# EAGLE design NFCAccessController (EAGLE 6.2)
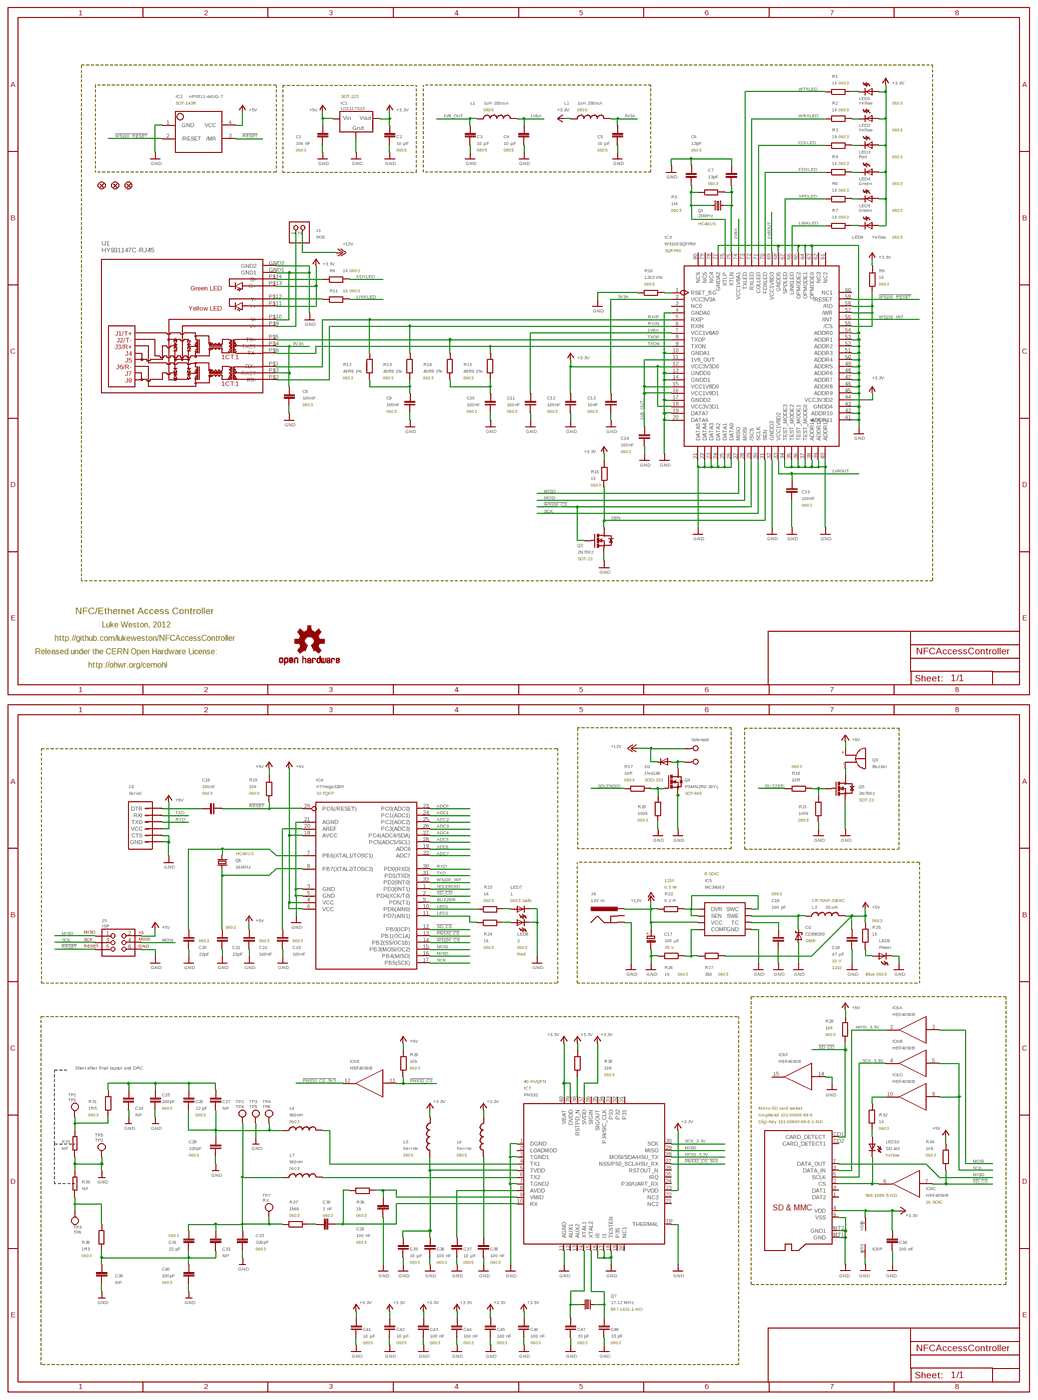
[diagram p0: schematic, sheet 1, overview]
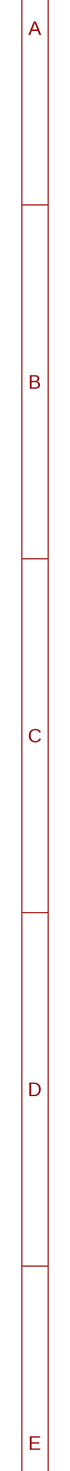
[diagram p1: schematic, sheet 1, part 1 of 4]
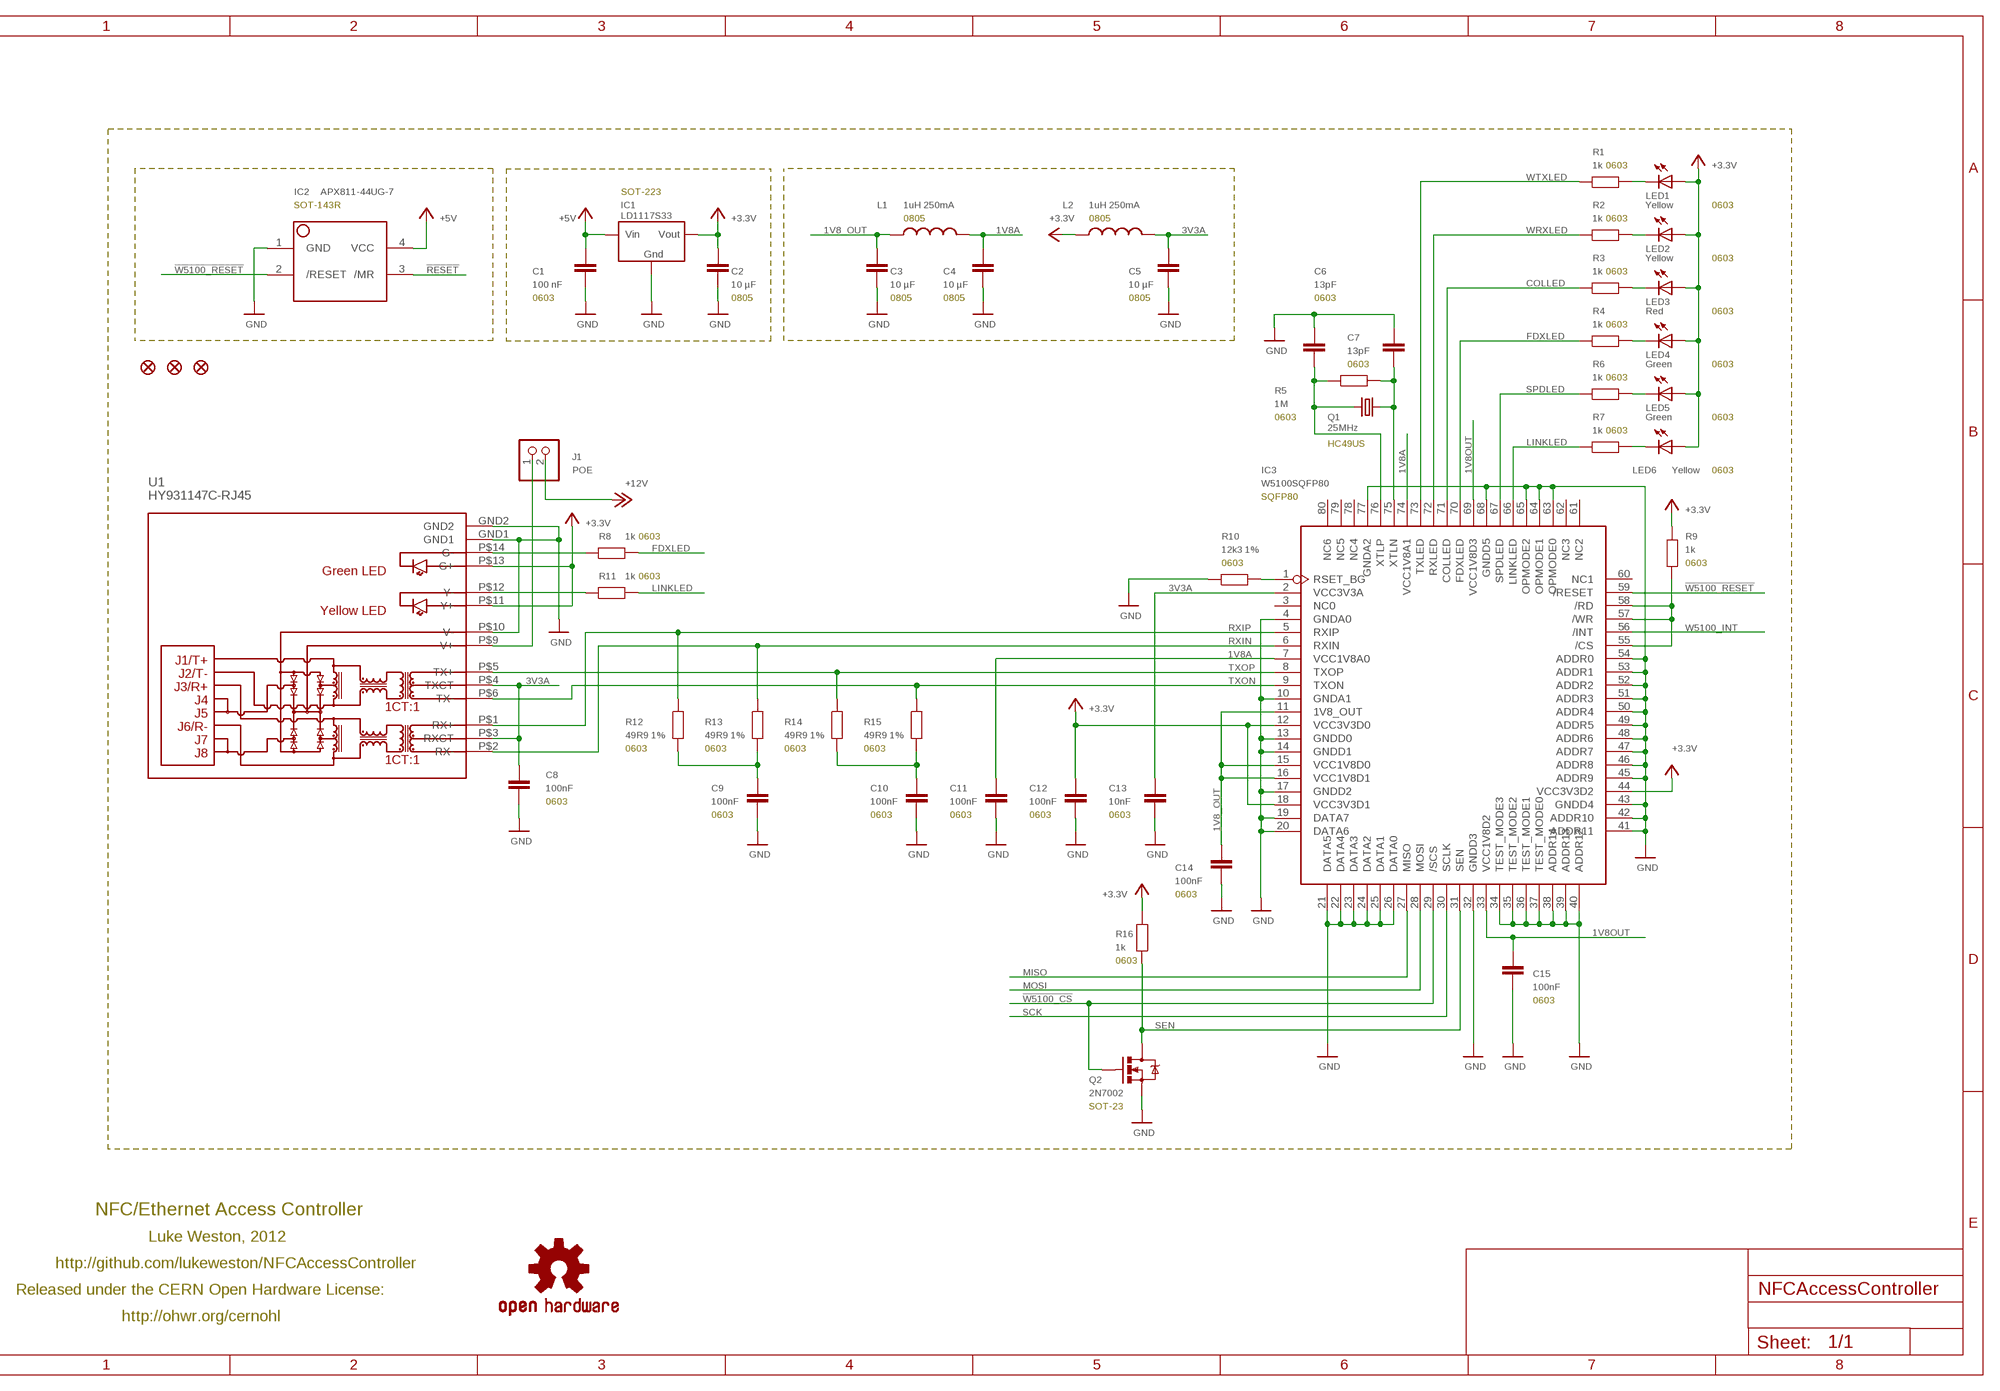
[diagram p2: schematic, sheet 1, part 2 of 4]
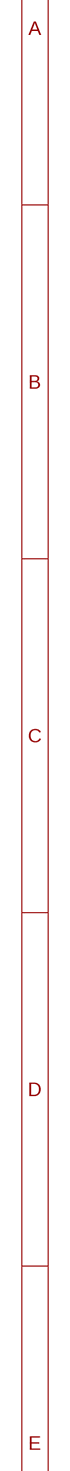
[diagram p3: schematic, sheet 1, part 3 of 4]
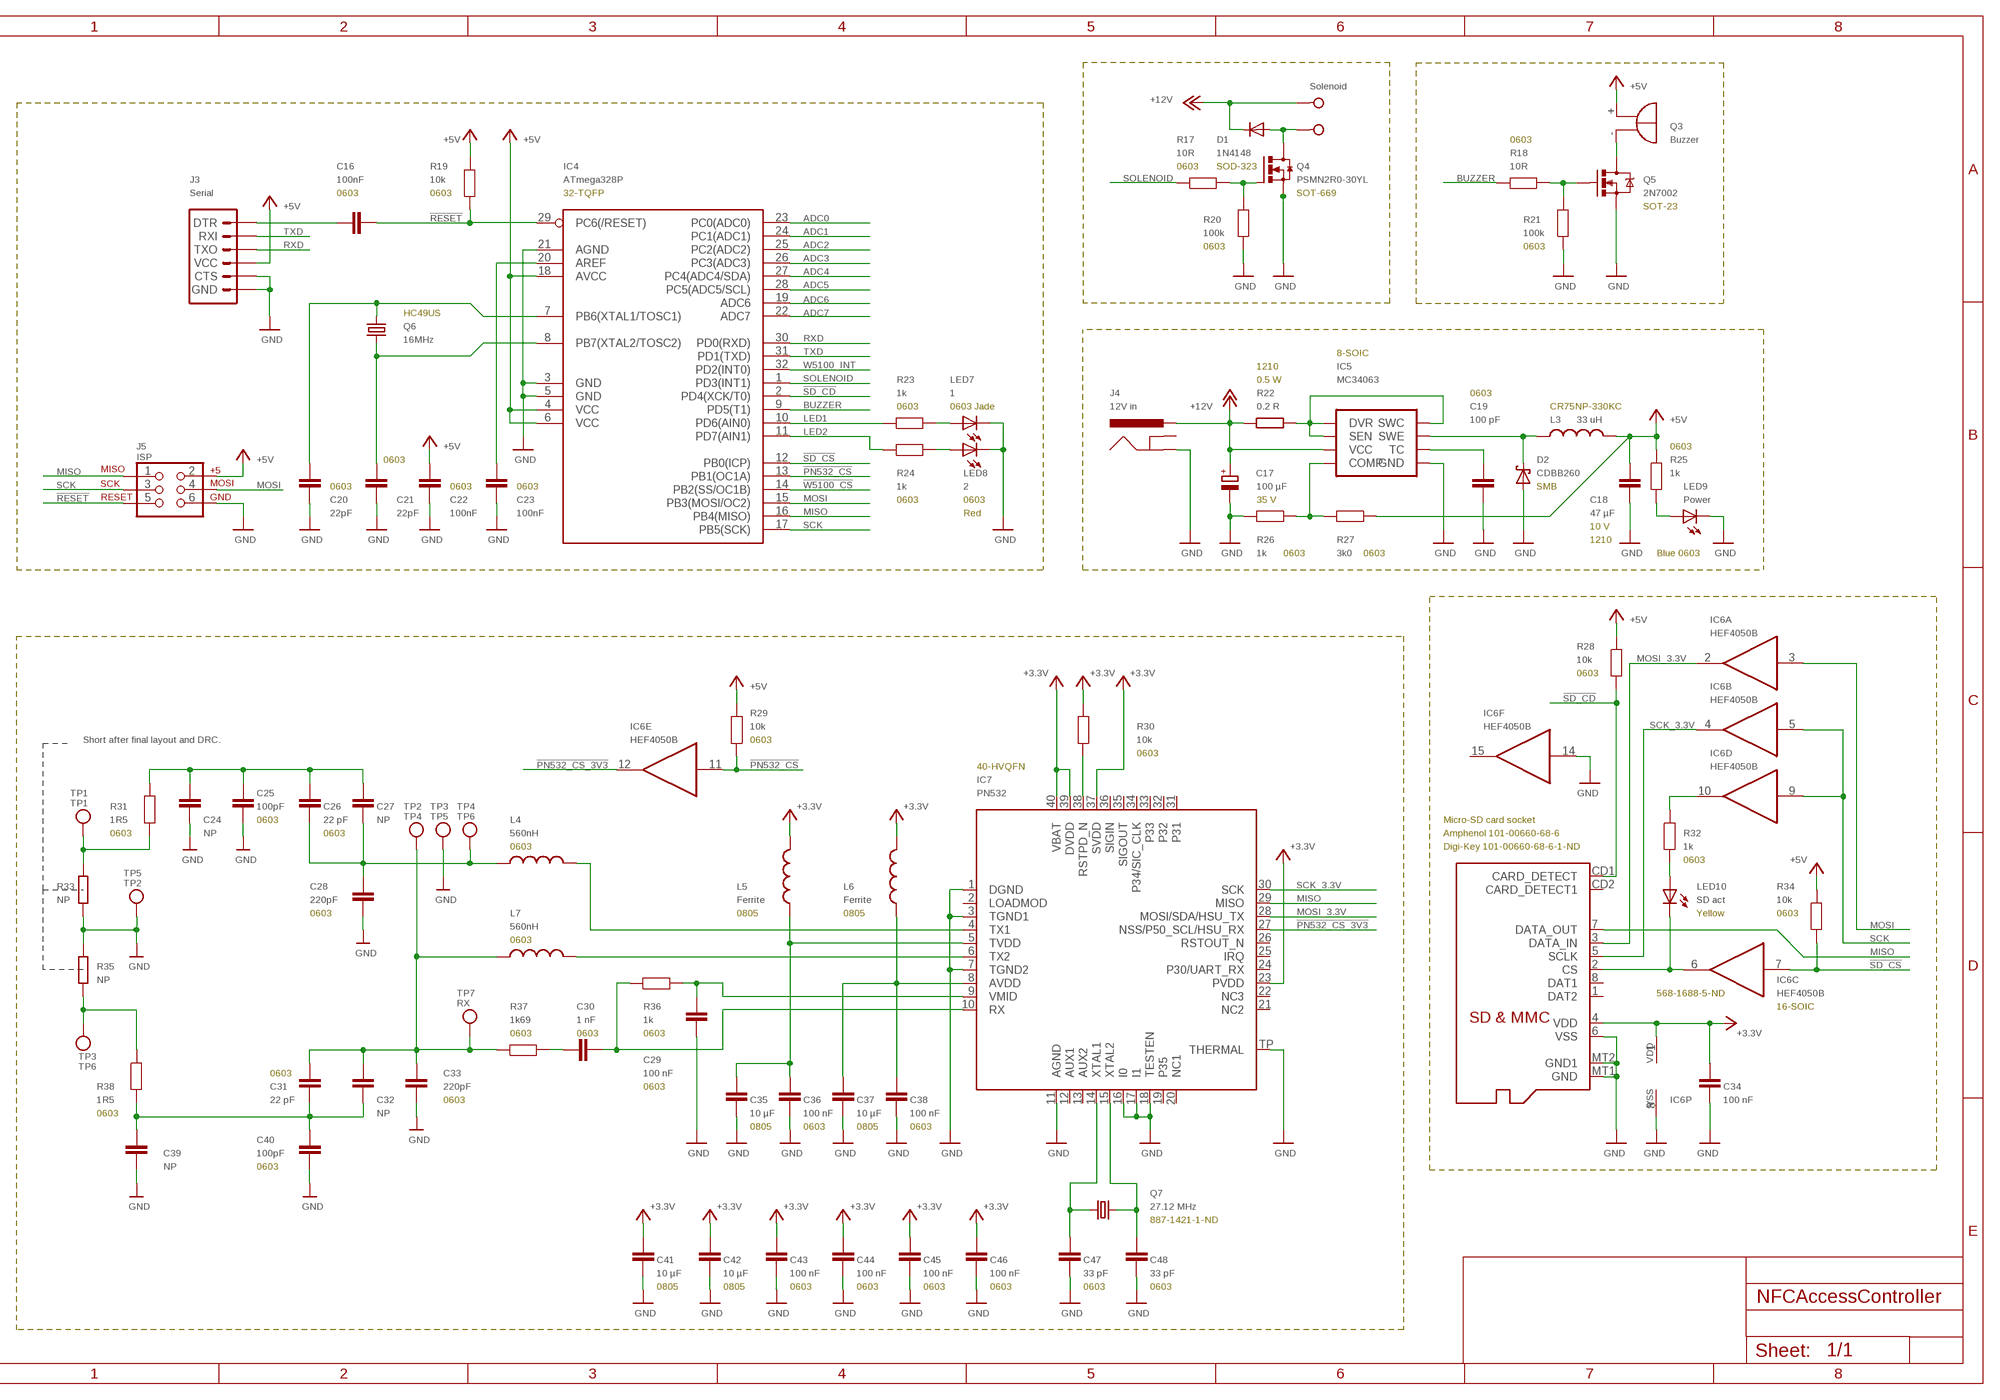
[diagram p4: schematic, sheet 1, part 4 of 4]

## Parts
C1  100 nF  CAP0603  [0603]
C2  10 µF  CAP0805  [0805]
C3  10 µF  CAP0805  [0805]
C4  10 µF  CAP0805  [0805]
C5  10 µF  CAP0805  [0805]
C6  13pF  CAP0603  [0603]
C7  13pF  CAP0603  [0603]
C8  100nF  CAP0603  [0603]
C9  100nF  CAP0603  [0603]
C10  100nF  CAP0603  [0603]
C11  100nF  CAP0603  [0603]
C12  100nF  CAP0603  [0603]
C13  10nF  CAP0603  [0603]
C14  100nF  CAP0603  [0603]
C15  100nF  CAP0603  [0603]
C16  100nF  CAP0603  [0603]
C17  100 µF  CPOL-EUE2.5-6  [E2,5-6]
C18  47 µF  C-EUC1210  [C1210]
C19  100 pF  CAP0603  [0603]
C20  22pF  CAP0603  [0603]
C21  22pF  CAP0603  [0603]
C22  100nF  CAP0603  [0603]
C23  100nF  CAP0603  [0603]
C24  NP  CAP0603  [0603]
C25  100pF  CAP0603  [0603]
C26  22 pF  CAP0603  [0603]
C27  NP  CAP0603  [0603]
C28  220pF  CAP0603  [0603]
C29  100 nF  CAP0603  [0603]
C30  1 nF  CAP0603  [0603]
C31  22 pF  CAP0603  [0603]
C32  NP  CAP0603  [0603]
C33  220pF  CAP0603  [0603]
C34  100 nF  CAP0603  [0603]
C35  10 µF  CAP0805  [0805]
C36  100 nF  CAP0603  [0603]
C37  10 µF  CAP0805  [0805]
C38  100 nF  CAP0603  [0603]
C39  NP  CAP0603  [0603]
C40  100pF  CAP0603  [0603]
C41  10 µF  CAP0805  [0805]
C42  10 µF  CAP0805  [0805]
C43  100 nF  CAP0603  [0603]
C44  100 nF  CAP0603  [0603]
C45  100 nF  CAP0603  [0603]
C46  100 nF  CAP0603  [0603]
C47  33 pF  CAP0603  [0603]
C48  33 pF  CAP0603  [0603]
D1  1N4148  DIODESOD  [SOD-323]
D2  CDBB260  MBRS130LT3  [SMB]
FID1  FIDUCIAL1X2.5  [FIDUCIAL-1X2.5]
FID2  FIDUCIAL1X2.5  [FIDUCIAL-1X2.5]
FID3  FIDUCIAL1X2.5  [FIDUCIAL-1X2.5]
IC1  LD1117S33  REG1117  [SOT223]
IC2  APX811-44UG-7  APX81X-RESET-IC  [SOT143-R]
IC3  W5100SQFP80  [SQFP80]
IC4  ATmega328P  AVR-MEGA8-AI  [TQFP32-08]
IC5  MC34063  MC34063SMD  [SO08]
IC6  HEF4050B  4050D  [SO16]
IC7  PN532  [HVQFN40-6X6]
J1  POE  PINHD-1X2  [1X02]
J2  Solenoid  W237-02P  [W237-132]
J3  Serial  ARDUINO_SERIAL_PROGRAMLONGPADS  [1X06_LONGPADS]
J4  12V in  POWER_JACKSLT  [POWER_JACK_SLOT]
J5  ISP  AVR_SPI_PRG_6NS  [2X3-NS]
J6  MicroSD Card  ADAFRUIT_MICROSD  [ADAFRUIT_MICROSD]
L1  1uH 250mA  L-USL2012C  [L2012C]
L2  1uH 250mA  L-USL2012C  [L2012C]
L3  33 uH  INDUCTORCR75  [CR75]
L4  560nH  INDUCTOR0603  [0603]
L5  Ferrite  INDUCTOR0805-LARGE  [0805-LARGE]
L6  Ferrite  INDUCTOR0805-LARGE  [0805-LARGE]
L7  560nH  INDUCTOR0603  [0603]
LED1  Yellow  LED0603  [LED-0603]
LED2  Yellow  LED0603  [LED-0603]
LED3  Red  LED0603  [LED-0603]
LED4  Green  LED0603  [LED-0603]
LED5  Green  LED0603  [LED-0603]
LED6  Yellow  LED0603  [LED-0603]
LED7  1  LED0603  [LED-0603]
LED8  2  LED0603  [LED-0603]
LED9  Power  LED0603  [LED-0603]
LED10  SD act  LED0603  [LED-0603]
Q1  25MHz  CRYSTALHC49UV  [HC49U-V]
Q2  2N7002  MOSFET-NCHANNELSMD  [SOT23-3]
Q3  Buzzer  F/TMB  [F/TMB]
Q4  PSMN2R0-30YL  PH7030L  [SOT669]
Q5  2N7002  MOSFET-NCHANNELSMD  [SOT23-3]
Q6  16MHz  CRYSTALHC49UV  [HC49U-V]
Q7  27.12 MHz  CRYSTAL5X3  [CRYSTAL-SMD-5X3]
R1  1k  RESISTOR0603  [0603]
R2  1k  RESISTOR0603  [0603]
R3  1k  RESISTOR0603  [0603]
R4  1k  RESISTOR0603  [0603]
R5  1M  RESISTOR0603  [0603]
R6  1k  RESISTOR0603  [0603]
R7  1k  RESISTOR0603  [0603]
R8  1k  RESISTOR0603  [0603]
R9  1k  RESISTOR0603  [0603]
R10  12k3 1%  RESISTOR0603  [0603]
R11  1k  RESISTOR0603  [0603]
R12  49R9 1%  RESISTOR0603  [0603]
R13  49R9 1%  RESISTOR0603  [0603]
R14  49R9 1%  RESISTOR0603  [0603]
R15  49R9 1%  RESISTOR0603  [0603]
R16  1k  RESISTOR0603  [0603]
R17  10R  RESISTOR0603  [0603]
R18  10R  RESISTOR0603  [0603]
R19  10k  RESISTOR0603  [0603]
R20  100k  RESISTOR0603  [0603]
R21  100k  RESISTOR0603  [0603]
R22  0.2 R  R-EU_R1210  [R1210]
R23  1k  RESISTOR0603  [0603]
R24  1k  RESISTOR0603  [0603]
R25  1k  RESISTOR0603  [0603]
R26  1k  RESISTOR0603  [0603]
R27  3k0  RESISTOR0603  [0603]
R28  10k  RESISTOR0603  [0603]
R29  10k  RESISTOR0603  [0603]
R30  10k  RESISTOR0603  [0603]
R31  1R5  RESISTOR0603  [0603]
R32  1k  RESISTOR0603  [0603]
R33  NP  R-EU_R0201  [R0201]
R34  10k  RESISTOR0603  [0603]
R35  NP  R-EU_R0201  [R0201]
R36  1k  RESISTOR0603  [0603]
R37  1k69  RESISTOR0603  [0603]
R38  1R5  RESISTOR0603  [0603]
S$1  OSHW-LOGOS  [OSHW-LOGO-S]
TP1  TP1  TESTPOINTPAD  [TESTPOINT_PAD_2MM]
TP2  TP4  TESTPOINTPAD  [TESTPOINT_PAD_2MM]
TP3  TP5  TESTPOINTPAD  [TESTPOINT_PAD_2MM]
TP4  TP6  TESTPOINTPAD  [TESTPOINT_PAD_2MM]
TP5  TP2  TESTPOINTPAD  [TESTPOINT_PAD_2MM]
TP6  TP3  TESTPOINTPAD  [TESTPOINT_PAD_2MM]
TP7  RX  TESTPOINTPAD  [TESTPOINT_PAD_2MM]
U1  HY931147C-RJ45  [HY931147C]

## Nets
1V8_OUT: C3.1 C14.1 IC3.11(1V8_OUT) IC3.15(VCC1V8D0) IC3.16(VCC1V8D1) L1.1
1V8A: C4.1 C11.1 IC3.7(VCC1V8A0) IC3.74(VCC1V8A1) L1.2
1V8OUT: C15.1 IC3.33(VCC1V8D2) IC3.69(VCC1V8D3)
3V3A: C5.1 C8.1 C13.1 IC3.2(VCC3V3A) L2.2 U1.P$3(RXCT) U1.P$4(TXCT)
!PN532_CS: IC4.13(PB1(OC1A)) IC6.11(E:I) R29.2
!PN532_CS_3V3: IC6.12(E:O) IC7.27(NSS/P50_SCL/HSU_RX)
!RESET: C16.2 IC2.3(/MR) IC4.29(PC6(/RESET)) J5.5 R19.1
!SD_CD: IC4.2(PD4(XCK/T0)) J6.CD1(CARD_DETECT) R28.1
!SD_CS: IC4.12(PB0(ICP)) IC6.7(C:I) R34.1
!W5100_CS: IC3.29(/SCS) IC4.14(PB2(SS/OC1B)) Q2.1(G)
!W5100_RESET: IC2.2(/RESET) IC3.59(/RESET)
+3V3: C2.1 C12.1 C34.1 C41.1 C42.1 C43.1 C44.1 C45.1 C46.1 IC1.2(VOUT) IC3.12(VCC3V3D0) IC3.18(VCC3V3D1) IC3.44(VCC3V3D2) IC6.1(P:VDD) IC7.23(PVDD) IC7.37(SVDD) IC7.39(DVDD) IC7.40(VBAT) J6.4(VDD) L2.1 L5.2 L6.2 LED1.A LED2.A LED3.A LED4.A LED5.A LED6.A R9.1 R16.1 R30.1 U1.P$11(Y+) U1.P$13(G+) ; supply symbol labelled +3.3V
+5V: C1.1 C18.1 C22.1 IC1.3(VIN) IC2.4(VCC) IC4.4(VCC) IC4.6(VCC) IC4.18(AVCC) J3.4(VCC) J5.2 L3.P$2 Q3.+ R19.2 R25.2 R27.1 R28.2 R29.1 R34.2
+12V: C17.+ D1.1(C) IC5.6(VCC) J1.2 J2.1 J4.PWR R22.1
ADC0: IC4.23(PC0(ADC0))
ADC1: IC4.24(PC1(ADC1))
ADC2: IC4.25(PC2(ADC2))
ADC3: IC4.26(PC3(ADC3))
ADC4: IC4.27(PC4(ADC4/SDA))
ADC5: IC4.28(PC5(ADC5/SCL))
ADC6: IC4.19(ADC6)
ADC7: IC4.22(ADC7)
AREF: C23.1 IC4.20(AREF)
BUZZER: IC4.9(PD5(T1)) R18.1
COLLED: IC3.71(COLLED) R3.1
FDXLED: IC3.70(FDXLED) R4.1 R8.2
FOO: IC6.6(C:O) J6.2(CS) LED10.C
GND: C1.2 C2.2 C3.2 C4.2 C5.2 C6.1 C7.1 C8.2 C9.2 C10.2 C11.2 C12.2 C13.2 C14.2 C15.2 C17.- C18.2 C19.2 C20.2 C21.2 C22.2 C23.2 C24.1 C25.1 C28.1 C29.2 C33.2 C34.2 C35.2 C36.2 C37.2 C38.2 C39.2 C40.2 C41.2 C42.2 C43.2 C44.2 C45.2 C46.2 C47.2 C48.2 D2.A IC1.1(GND) IC2.1(GND) IC3.4(GNDA0) IC3.10(GNDA1) IC3.13(GNDD0) IC3.14(GNDD1) IC3.17(GNDD2) IC3.19(DATA7) IC3.20(DATA6) IC3.21(DATA5) IC3.22(DATA4) IC3.23(DATA3) IC3.24(DATA2) IC3.25(DATA1) IC3.26(DATA0) IC3.32(GNDD3) IC3.34(TEST_MODE3) IC3.35(TEST_MODE2) IC3.36(TEST_MODE1) IC3.37(TEST_MODE0) IC3.38(ADDR14) IC3.39(ADDR13) IC3.40(ADDR12) IC3.41(ADDR11) IC3.42(ADDR10) IC3.43(GNDD4) IC3.45(ADDR9) IC3.46(ADDR8) IC3.47(ADDR7) IC3.48(ADDR6) IC3.49(ADDR5) IC3.50(ADDR4) IC3.51(ADDR3) IC3.52(ADDR2) IC3.53(ADDR1) IC3.54(ADDR0) IC3.63(OPMODE0) IC3.64(OPMODE1) IC3.65(OPMODE2) IC3.68(GNDD5) IC3.77(GNDA2) IC4.3(GND) IC4.5(GND) IC4.21(AGND) IC5.4(GND) IC6.8(P:VSS) IC6.14(F:I) IC7.1(DGND) IC7.3(TGND1) IC7.7(TGND2) IC7.11(AGND) IC7.16(I0) IC7.17(I1) IC7.18(TESTEN) IC7.TP(THERMAL) J3.5(CTS) J3.6(GND) J4.GND J5.6 J6.6(VSS) J6.MT1(GND) J6.MT2(GND1) LED7.C LED8.C LED9.C Q2.2(S) Q4.1(S) Q4.2(S) Q4.3(S) Q5.2(S) R10.1 R20.2 R21.1 R26.2 R33.1 R35.2 TP3.P$1 TP5.P$1 U1.GND1 U1.GND2 U1.P$10(V-)
LED1: IC4.10(PD6(AIN0)) R23.1
LED2: IC4.11(PD7(AIN1)) R24.1
LINKLED: IC3.66(LINKLED) R7.1 R11.2
MISO: IC3.27(MISO) IC4.16(PB4(MISO)) IC7.29(MISO) J5.1 J6.7(DATA_OUT)
MOSI: IC3.28(MOSI) IC4.15(PB3(MOSI/OC2)) IC6.3(A:I) J5.4
MOSI_3.3V: IC6.2(A:O) IC7.28(MOSI/SDA/HSU_TX) J6.3(DATA_IN)
N$1: IC7.4(TX1) L4.2
N$2: IC7.6(TX2) L7.2
N$3: C26.1 C27.1 C28.2 L4.1 TP4.P$1
N$4: R31.1 R33.2 TP1.P$1
N$5: R35.1 R38.2 TP6.P$1
N$6: IC5.1(SWC) IC5.7(SEN) IC5.8(DVR) R22.2
N$7: C47.1 IC7.14(XTAL1) Q7.1
N$8: C48.1 IC7.15(XTAL2) Q7.3
N$9: C30.1 R37.2
N$10: C29.1 IC7.9(VMID) R36.2
N$11: C30.2 IC7.10(RX) R36.1
N$12: C31.2 C32.2 C33.1 L7.1 R37.1 TP2.P$1 TP7.P$1
N$13: C37.1 C38.1 IC7.8(AVDD) L6.1
N$14: C7.2 IC3.75(XTLN) Q1.1 R5.2
N$15: C35.1 C36.1 IC7.5(TVDD) L5.1
N$16: C19.1 IC5.3(TC)
N$17: IC5.5(COMP) R26.1 R27.2
N$18: LED9.A R25.1
N$19: C6.2 IC3.76(XTLP) Q1.2 R5.1
N$20: C9.1 R12.1 R13.1
N$21: D2.C IC5.2(SWE) L3.P$1
N$22: Q4.4(G) R17.2 R20.1
N$23: Q5.1(G) R18.2 R21.2
N$24: C10.1 R14.1 R15.1
N$26: D1.2(A) J2.2 Q4.MB(D)
N$30: Q3.- Q5.3(D)
N$44: LED7.A R23.2
N$45: LED8.A R24.2
N$50: C20.1 IC4.7(PB6(XTAL1/TOSC1)) Q6.2
N$51: C21.1 IC4.8(PB7(XTAL2/TOSC2)) Q6.1
N$55: IC3.55(/CS) IC3.57(/WR) IC3.58(/RD) R9.2
N$56: LED5.C R6.2
N$57: LED6.C R7.2
N$59: C16.1 J3.1(DTR)
N$62: LED10.A R32.1
N$63: IC6.10(D:O) R32.2
N$67: R8.1 U1.P$14(G-)
N$68: J1.1 U1.P$9(V+)
N$322: IC3.1(RSET_BG) R10.2
N$327: LED4.C R4.2
N$328: LED3.C R3.2
N$329: LED2.C R2.2
N$330: LED1.C R1.2
N$332: R11.1 U1.P$12(Y-)
RSTPD_N: IC7.38(RSTPD_N) R30.2
RXD: IC4.30(PD0(RXD)) J3.3(TXO)
RXIN: IC3.6(RXIN) R13.2 U1.P$2(RX-)
RXIP: IC3.5(RXIP) R12.2 U1.P$1(RX+)
SCK: IC3.30(SCLK) IC4.17(PB5(SCK)) IC6.5(B:I) IC6.9(D:I) J5.3
SCK_3.3V: IC6.4(B:O) IC7.30(SCK) J6.5(SCLK)
SEN: IC3.31(SEN) Q2.3(D) R16.2
SOLENOID: IC4.1(PD3(INT1)) R17.1
SPDLED: IC3.67(SPDLED) R6.1
TX1_ANTENNA: C24.2 C25.2 C26.2 C27.2 R31.2
TX2_ANTENNA: C31.1 C32.1 C39.1 C40.1 R38.1
TXD: IC4.31(PD1(TXD)) J3.2(RXI)
TXON: IC3.9(TXON) R15.2 U1.P$6(TX-)
TXOP: IC3.8(TXOP) R14.2 U1.P$5(TX+)
W5100_INT: IC3.56(/INT) IC4.32(PD2(INT0))
WRXLED: IC3.72(RXLED) R2.1
WTXLED: IC3.73(TXLED) R1.1
Unconnected: IC3.3(NC0) IC3.60(NC1) IC3.61(NC2) IC3.62(NC3) IC3.78(NC4) IC3.79(NC5) IC3.80(NC6) IC6.15(F:O) IC7.2(LOADMOD) IC7.12(AUX1) IC7.13(AUX2) IC7.19(P35) IC7.20(NC1) IC7.21(NC2) IC7.22(NC3) IC7.24(P30/UART_RX) IC7.25(IRQ) IC7.26(RSTOUT_N) IC7.31 IC7.32 IC7.33 IC7.34(P34/SIC_CLK) IC7.35(SIGOUT) IC7.36(SIGIN) J4.SW(GNDBREAK) J6.1(DAT2) J6.8(DAT1) J6.CD2(CARD_DETECT1)

## Notes on the sheet
- 0603
- SOT-223
- SOT-143R | 0603
- 0805 | 0805 | 0603
- 0603
- 0603
- 0603 | 0805 | 0805 | 0805 | 0805 | 0603
- 0603
- 0603
- 0603 | 0603
- 0603
- 0603 | 0603
- 0603
- HC49US
- 0603
- SQFP80
- 0603
- 0603 | 0603
- 0603
- 0603 | 0603 | 0603 | 0603
- 0603
- 0603 | 0603 | 0603 | 0603 | 0603
- 0603
- 0603
- 0603
- SOT-23
- NFC/Ethernet Access Controller
- Luke Weston, 2012
- http://github.com/lukeweston/NFCAccessController
- Released under the CERN Open Hardware License:
- http://ohwr.org/cernohl
- 0603
- 0603 | SOD-323
- 0603 | 0603 | 32-TQFP | SOT-669
- SOT-23
- 0603 | 0603
- HC49US
- 8-SOIC
- 1210
- 0.5 W
- 0603
- 0603 | 0603 Jade | CR75NP-330KC
- 0603
- 0603
- 0603 | 0603 | 0603 | SMB
- 0603 | 0603 | 35 V
- Red
- 10 V
- 1210
- 0603 | 0603 | Blue 0603
- 0603
- Short after final layout and DRC. | 0603
- 0603
- 40-HVQFN
- 0603 | Micro-SD card socket
- 0603 | 0603 | Amphenol 101-00660-68-6
- 0603 | Digi-Key 101-00660-68-6-1-ND
- 0603
- 0603 | 0805 | 0805 | Yellow | 0603
- 0603
- 568-1688-5-ND
- 16-SOIC
- 0603 | 0603 | 0603
- 0603
- 0603
- 0603
- 0603
- 0805 | 0603 | 0805 | 0603
- 0603
- 887-1421-1-ND
- 0805 | 0805 | 0603 | 0603 | 0603 | 0603 | 0603 | 0603

## Library data of the parts
C1-C16 C19-C48 = freetronics-master-v1:CAP: Capacitor Standard 0603 ceramic capacitor, and 0.1" leaded capacitor.
C17 = rcl:CPOL-EU: POLARIZED CAPACITOR, European symbol
C18 = rcl:C-EU: CAPACITOR, European symbol
D1 = SparkFun:DIODE: Diode These are standard reverse protection diodes and small signal diodes. SMA package can handle up to about 1A. SOD-323 can handle about 200mA. What the SOD-323 package when ordering, there are some mfgs out there that are 5-pin packages.
D2 = diode:MBRS130LT3: Schottky Power Rectifier Source: http://www.onsemi.com/pub/Collateral/MBRS130LT3-D.PDF
FID1-FID3 = freetronics:FIDUCIAL: Fiducial Alignment Points Various fiducial points for machine vision alignment.
IC1 = burr-brown:REG1117: 800mA and 1A Low Dropout (LDO) Positive Regulator 1.8V, 2.5V, 2.85V, 3.3V, 5V, and Adj; MPN: REG1117; OC_FARNELL: 1097566; OC_NEWARK: 14P6981
IC2 = freetronics-master-v1:APX81X-RESET-IC
IC3 = freetronics-marc:W5100: WIZnet W5100
IC4 = freetronics-2:AVR-MEGA8: MICROCONTROLLER 8 Kbytes FLASH 1 kbytes SRAM 512 bytes EEPROM USART 6-channel 10 bit ADC 2-channel 8 bit ADC
IC5 = SparkFun:MC34063
IC6 = 40xx:4050: Hex non-inverting BUFFER
IC7 = microbuilder:PN532: PN532 - Near Field Communication (NFC) controller Highly integrated transceiver module for contactless communication at 13.56 MHz (14443A/MIFARE, FeliCa, I4443B)
J1 = pinhead:PINHD-1X2: PIN HEADER
J2 = con-wago-508:W237-02P: WAGO SREW CLAMP; OC_FARNELL: unknown; OC_NEWARK: unknown
J3 = SparkFun:ARDUINO_SERIAL_PROGRAM
J4 = SparkFun:POWER_JACK: Power Jack This is the standard 5.5mm barrel jack for power. The PTH is the most common, proven, reliable, footprint. All others are experimental. The Slot footprint only works if the mill layer is transmitted to the PCB fab house so be warned. Spark Fun Electronics SKU : PRT-00119. Mating wall wart : TOL-00298 (and others)
J5 = SparkFun:AVR_SPI_PRG_6: AVR ISP 6 Pin This is the reduced ISP connector for AVR programming. Common on Arduino. This footprint will take up less PCB space and can be used with a 10-pin to 6-pin adapter such as SKU: BOB-08508
J6 = RAMPSdisplay:ADAFRUIT_MICROSD: Micro-SD / Transflash card holder with SPI pinout For the 3M # 2908-05WB-MG and/or 4UCON #19656 push-push type
L1 L2 = rcl:L-US: INDUCTOR, American symbol
L3 = SparkFun:INDUCTOR: Inductors
L4 L7 = microbuilder:INDUCTOR: Inductors
L5 L6 = freetronics-master-v1:INDUCTOR: Inductors
LED1-LED10 = freetronics-master-v1:LED: LEDs Standard schematic elements and footprints for 5mm, 3mm, 1206, and 0603 sized LEDs. 5mm - Spark Fun Electronics SKU : COM-00529 (and others)
Q1 Q6 = freetronics-master-v1:CRYSTAL: Crystals Various standard crystals. Proven footprints. Spark Fun Electronics SKU : COM-00534
Q2 = freetronics:MOSFET-NCHANNEL
Q3 = buzzer:F/TMB: BUZZER Source: Buerklin; OC_FARNELL: unknown; OC_NEWARK: unknown
Q4 = transistor-power:PH7030L: N-channel TrenchMOS (TM) logic level FET Source: http://www.nxp.com/acrobat_download/datasheets/PH7030L_4.pdf
Q5 = freetronics-master-v1:MOSFET-NCHANNEL
Q7 = SparkFun:CRYSTAL: Crystals Various standard crystals. Proven footprints. Spark Fun Electronics SKU : COM-00534
R1-R21 R23-R32 R34 R36-R38 = freetronics-master-v1:RESISTOR: Resistor Basic schematic elements and footprints for 0603, 1206, and PTH 1/10th watt (small) resistors.
R22 R33 R35 = rcl:R-EU_: RESISTOR, European symbol
S$1 = SparkFun:OSHW-LOGO: Open Source Hardware Logo This logo indicates the piece of hardware it is found on incorporates a OSHW license and/or adheres to the definition of open source hardware found here: http://freedomdefined.org/OSHW
TP1-TP7 = microbuilder:TESTPOINT: Test Point TESTPOINT_SMT - Compact Surface Mount Test Point [Digikey: 5016KTR-ND] TESTPOINT_PAD - Square Pad (2mm) TESTPOINT_SMT - Round Pad (2mm) TESTPOINT_0.1" - 0.1" Header
U1 = freetronics-jon:HY931147C

## Board
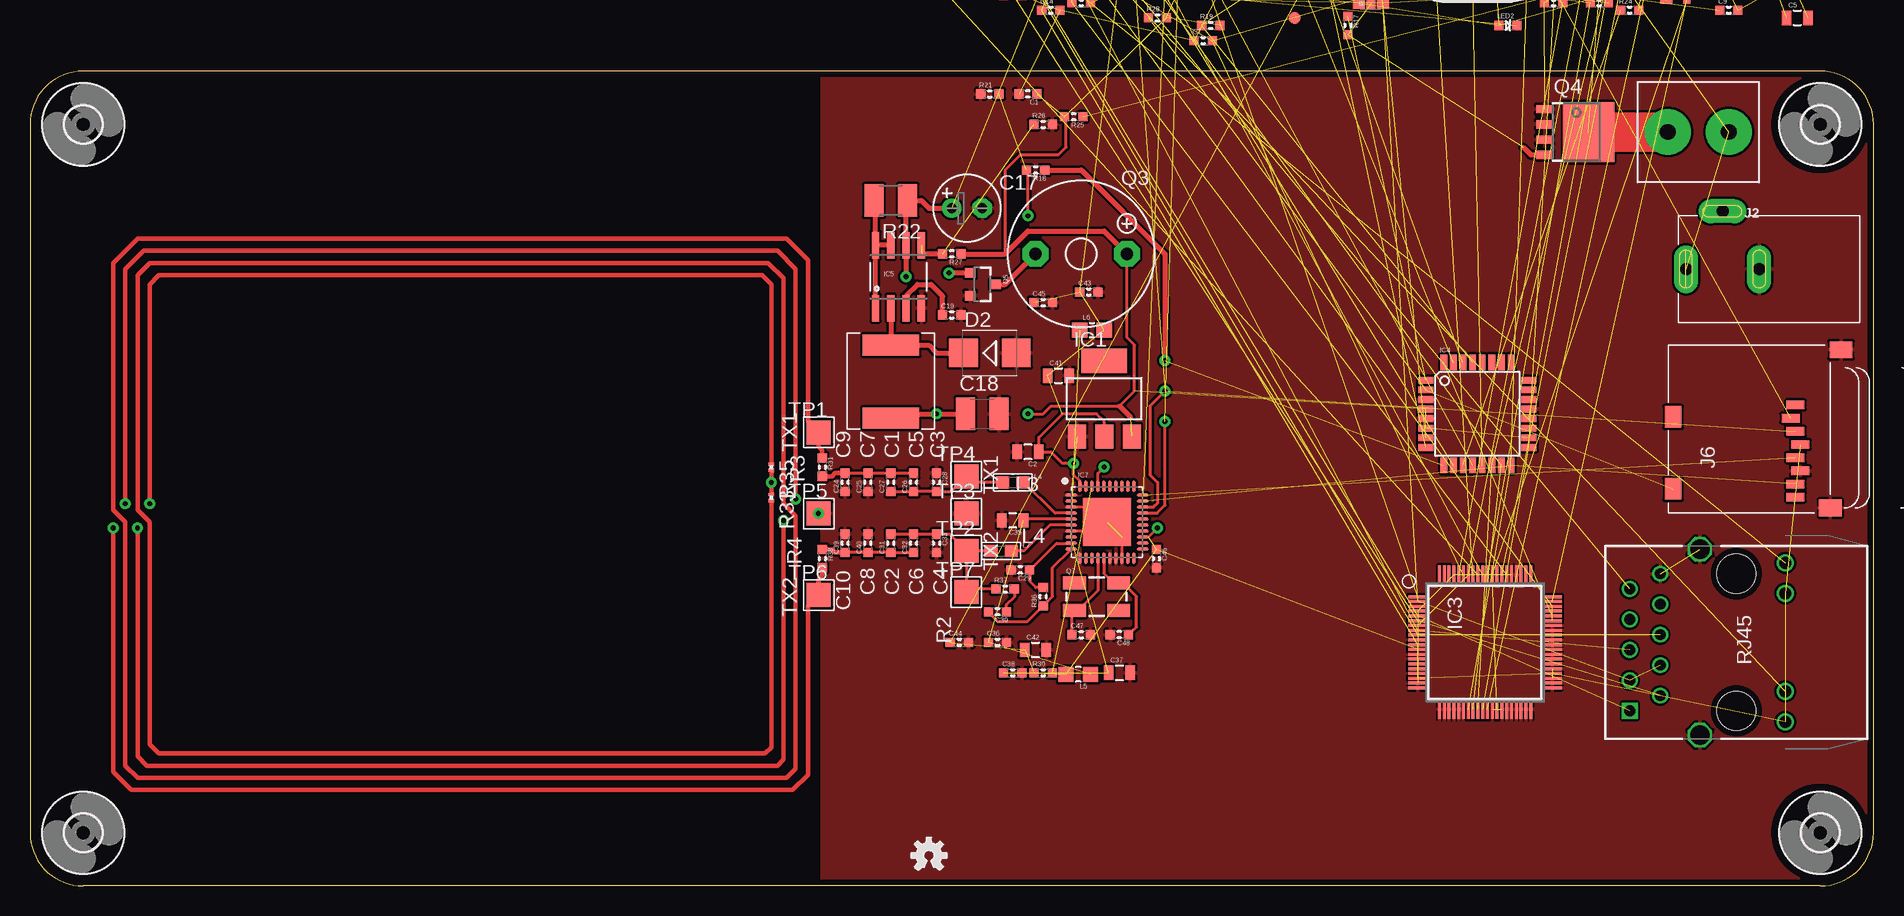
[diagram p5: board, top side]
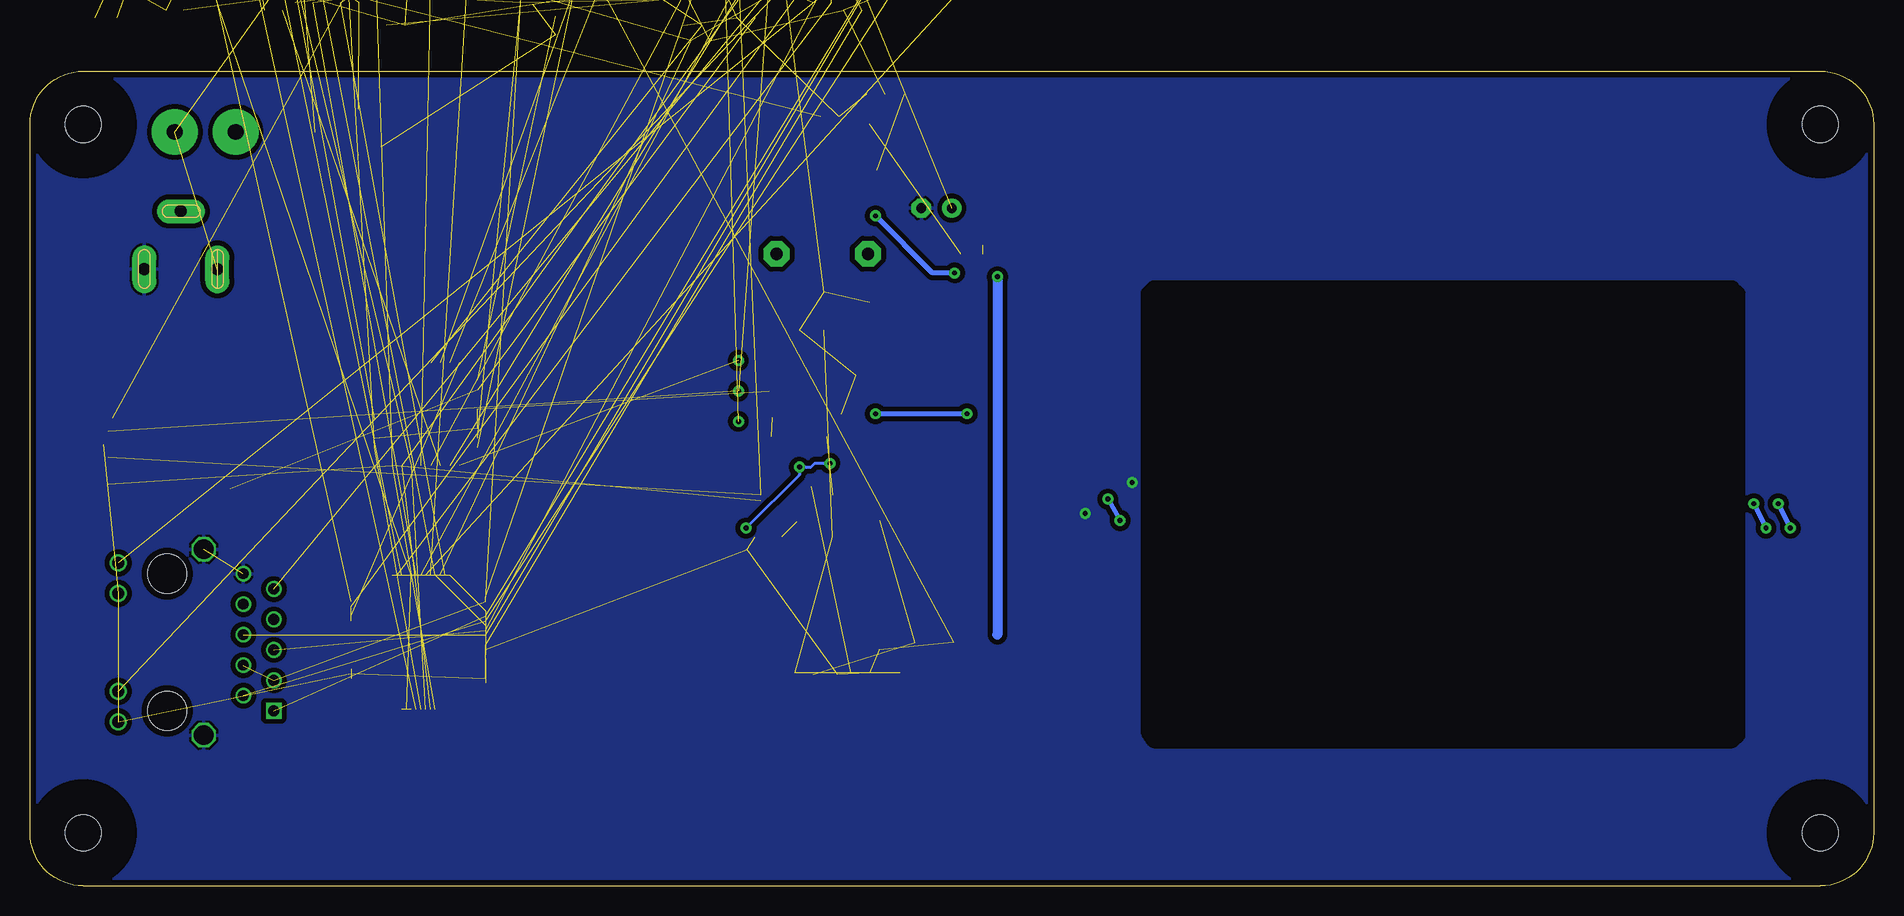
[diagram p6: board, bottom side, seen from below]

Size 153.67 x 67.94 mm. Coordinates in mm from the lower left corner, seen from the top.
Outline: 149.22,0 arc90 153.67,4.44 153.67,63.5 arc90 149.22,67.94 4.45,67.94 arc90 0,63.5 0,4.44 arc90 4.45,0 149.22,0
Copper layers (1*16): Top 0.035mm / dielectric 1.5mm / Bottom 0.035mm
Design rules: minimum track width 8mil, minimum drill 0.4mm, track to track 8mil, track to pad 8mil, pad to pad 8mil, via to via 8mil, smd to smd 8mil, copper to edge 20mil, drill to drill 8mil, minimum pad ring 8mil, minimum via ring 10mil, stop-mask expansion 3mil, vias tented up to drill 0mil, thermal gap 8mil
tRestrict: area 86.4,32.8 to 87.1,32.9; area 87.4,30.1 to 87.7,30.6; area 89.5,32.4 to 90,32.6; area 91.8,30.1 to 92,30.6; area 89.2,28.1 to 90.2,28.3
bRestrict: area 11.2,12.1 to 60.5,49.9

### Footprints (pad centres in the part's own frame; a part is rotated, then mirrored left to right if it is on the bottom)
0603 = smd 0.762 x 0.762: 1 -0.762,0; 2 0.762,0
0805 = smd 0.8 x 1.2: 1 -0.9,0; 2 0.9,0
E2,5-6 = drill 0.813 pad 1.6: + -1.27,0 | drill 0.813 pad 1.6 octagon: - 1.27,0
C1210 = smd 1.6 x 2.7: 1 -1.4,0; 2 1.4,0
SOD-323 = smd 0.63 x 0.83: 1 -1.15,0; 2 1.15,0
SMB = smd 2.4 x 2.4: A 2.2,0; C -2.2,0
FIDUCIAL-1X2.5 = smd 1 x 1: 1 0,0
SOT223 = smd 1.499 x 2.007: 1 -2.261,-3.15; 2 0.025,-3.15; 3 2.311,-3.15 | smd 3.81 x 2.007: 4 0,3.15
SOT143-R = smd 1 x 0.7: 1 -0.75,-1 | smd 0.6 x 0.7: 2 0.95,-1; 3 0.95,1; 4 -0.95,1
SQFP80 = smd 1.6 x 0.25: 1 -5.6,3.8; 2 -5.6,3.4; 3 -5.6,3; 4 -5.6,2.6; 5 -5.6,2.2; 6 -5.6,1.8; 7 -5.6,1.4; 8 -5.6,1; 9 -5.6,0.6; 10 -5.6,0.2; 11 -5.6,-0.2; 12 -5.6,-0.6; 13 -5.6,-1; 14 -5.6,-1.4; 15 -5.6,-1.8; 16 -5.6,-2.2; 17 -5.6,-2.6; 18 -5.6,-3; 19 -5.6,-3.4; 20 -5.6,-3.8; 41 5.6,-3.8; 42 5.6,-3.4; 43 5.6,-3; 44 5.6,-2.6; 45 5.6,-2.2; 46 5.6,-1.8; 47 5.6,-1.4; 48 5.6,-1; 49 5.6,-0.6; 50 5.6,-0.2; 51 5.6,0.2; 52 5.6,0.6; 53 5.6,1; 54 5.6,1.4; 55 5.6,1.8; 56 5.6,2.2; 57 5.6,2.6; 58 5.6,3; 59 5.6,3.4; 60 5.6,3.8 | smd 0.25 x 1.6: 21 -3.8,-5.6; 22 -3.4,-5.6; 23 -3,-5.6; 24 -2.6,-5.6; 25 -2.2,-5.6; 26 -1.8,-5.6; 27 -1.4,-5.6; 28 -1,-5.6; 29 -0.6,-5.6; 30 -0.2,-5.6; 31 0.2,-5.6; 32 0.6,-5.6; 33 1,-5.6; 34 1.4,-5.6; 35 1.8,-5.6; 36 2.2,-5.6; 37 2.6,-5.6; 38 3,-5.6; 39 3.4,-5.6; 40 3.8,-5.6; 61 3.8,5.6; 62 3.4,5.6; 63 3,5.6; 64 2.6,5.6; 65 2.2,5.6; 66 1.8,5.6; 67 1.4,5.6; 68 1,5.6; 69 0.6,5.6; 70 0.2,5.6; 71 -0.2,5.6; 72 -0.6,5.6; 73 -1,5.6; 74 -1.4,5.6; 75 -1.8,5.6; 76 -2.2,5.6; 77 -2.6,5.6; 78 -3,5.6; 79 -3.4,5.6; 80 -3.8,5.6
TQFP32-08 = smd 1.27 x 0.559: 1 -4.293,2.8; 2 -4.293,2; 3 -4.293,1.2; 4 -4.293,0.4; 5 -4.293,-0.4; 6 -4.293,-1.2; 7 -4.293,-2; 8 -4.293,-2.8; 17 4.293,-2.8; 18 4.293,-2; 19 4.293,-1.2; 20 4.293,-0.4; 21 4.293,0.4; 22 4.293,1.2; 23 4.293,2; 24 4.293,2.8 | smd 0.559 x 1.27: 9 -2.8,-4.293; 10 -2,-4.293; 11 -1.2,-4.293; 12 -0.4,-4.293; 13 0.4,-4.293; 14 1.2,-4.293; 15 2,-4.293; 16 2.8,-4.293; 25 2.8,4.293; 26 2,4.293; 27 1.2,4.293; 28 0.4,4.293; 29 -0.4,4.293; 30 -1.2,4.293; 31 -2,4.293; 32 -2.8,4.293
SO08 = smd 0.61 x 2.21: 1 -1.905,-2.616; 2 -0.635,-2.616; 3 0.635,-2.616; 4 1.905,-2.616; 5 1.905,2.616; 6 0.635,2.616; 7 -0.635,2.616; 8 -1.905,2.616
SO16 = smd 0.66 x 2.032: 1 -4.445,-3.073; 2 -3.175,-3.073; 3 -1.905,-3.073; 4 -0.635,-3.073; 5 0.635,-3.073; 6 1.905,-3.073; 7 3.175,-3.073; 8 4.445,-3.073; 9 4.445,3.073; 10 3.175,3.073; 11 1.905,3.073; 12 0.635,3.073; 13 -0.635,3.073; 14 -1.905,3.073; 15 -3.175,3.073; 16 -4.445,3.073
HVQFN40-6X6 = smd 1 x 0.25: 1 -2.99,2.25; 2 -2.99,1.75; 3 -2.99,1.25; 4 -2.99,0.75; 5 -2.99,0.25; 6 -2.99,-0.25; 7 -2.99,-0.75; 8 -2.99,-1.25; 9 -2.99,-1.75; 10 -2.99,-2.25; 21 2.99,-2.25; 22 2.99,-1.75; 23 2.99,-1.25; 24 2.99,-0.75; 25 2.99,-0.25; 26 2.99,0.25; 27 2.99,0.75; 28 2.99,1.25; 29 2.99,1.75; 30 2.99,2.25 | smd 0.25 x 1: 11 -2.25,-2.99; 12 -1.75,-2.99; 13 -1.25,-2.99; 14 -0.75,-2.99; 15 -0.25,-2.99; 16 0.25,-2.99; 17 0.75,-2.99; 18 1.25,-2.99; 19 1.75,-2.99; 20 2.25,-2.99; 31 2.25,2.99; 32 1.75,2.99; 33 1.25,2.99; 34 0.75,2.99; 35 0.25,2.99; 36 -0.25,2.99; 37 -0.75,2.99; 38 -1.25,2.99; 39 -1.75,2.99; 40 -2.25,2.99 | smd 4 x 4: TP 0,0
1X02 = drill 0.9 pad 1.93: 1 -1.27,0; 2 1.27,0
W237-132 = drill 1.3 pad 3.81: 1 -2.54,0; 2 2.54,0
1X06_LONGPADS = drill 1.016 pad 1.88 long: 1 0,0; 2 2.54,0; 3 5.08,0; 4 7.62,0; 5 10.16,0; 6 12.7,0
POWER_JACK_SLOT = drill 1 pad 2 long: GND 0,0; PWR 0,6.096; SW 4.826,3.048
2X3-NS = drill 0.9 pad 1.778 square: 1 -2.54,-1.27 | drill 0.9 pad 1.778 octagon: 2 -2.54,1.27; 3 0,-1.27; 4 0,1.27; 5 2.54,-1.27; 6 2.54,1.27
ADAFRUIT_MICROSD = smd 0.7 x 1.5: 1 9,-10.64; 2 7.9,-10.24; 3 6.8,-10.64; 4 5.7,-11.04; 5 4.6,-10.64; 6 3.5,-11.04; 7 2.4,-10.64; 8 1.3,-10.64 | smd 1.8 x 1.4: CD1 2,-0.44; CD2 8,-0.44 | smd 1.4 x 1.9: MT1 0.4,-13.54; MT2 13.6,-14.44
L2012C = smd 1 x 1: 1 -1,0; 2 1,0
CR75 = smd 1.75 x 4.7: P$1 0,0; P$2 6.05,0
0603' = smd 1.1 x 1: 1 -0.85,0; 2 0.85,0
0805-LARGE = smd 1.27 x 1.27: 1 -1.016,0; 2 1.016,0
LED-0603 = smd 0.762 x 0.762: A -0.762,0; C 0.762,0
HC49U-V = drill 0.813: 1 -2.413,0; 2 2.413,0
SOT23-3 = smd 0.8 x 0.9: 1 -0.95,-1; 2 0.95,-1; 3 0,1.1
F/TMB = drill 1.016 pad 2.159 octagon: + 3.81,0; - -3.81,0
SOT669 = smd 0.7 x 1.4: 1 -1.905,-2.65; 2 -0.635,-2.65; 3 0.635,-2.65; 4 1.905,-2.65 | smd 5 x 4.3: MB 0,1
CRYSTAL-SMD-5X3 = smd 1.9 x 1.1: 1 -1.85,-1.15; 2 1.85,-1.15; 3 1.85,1.15; 4 -1.85,1.15
R1210 = smd 1.6 x 2.7: 1 -1.4,0; 2 1.4,0
R0201 = smd 0.28 x 0.43: 1 -0.255,0; 2 0.255,0
TESTPOINT_PAD_2MM = smd 2 x 2: P$1 0,0
HY931147C = drill 1.63 octagon: GND1 3.05,7.745; GND2 3.05,-7.745 | drill 0.9 square: P$1 8.89,5.715 | drill 0.9: P$2 6.35,4.445; P$3 8.89,3.175; P$4 6.35,1.905; P$5 8.89,0.635; P$6 6.35,-0.635; P$7 8.89,-1.905; P$8 6.35,-3.175; P$9 8.89,-4.445; P$10 6.35,-5.715 | drill 1.016: P$11 -4.08,6.625; P$12 -4.08,4.085; P$13 -4.08,-4.085; P$14 -4.08,-6.625 | hole 3.25: 0,5.715; 0,-5.715
MOUNTINGHOLE_3.0 = hole 3: 0,0

### Placement (x,y rotation side)
C1  83.19,66.04 180 top
C2  83.19,36.2 180 top
C3  116.84,87.63 0 top  (outside the outline)
C4  130.81,77.47 0 top  (outside the outline)
C5  147.32,72.39 0 top  (outside the outline)
C6  127,73.66 0 top  (outside the outline)
C7  97.79,70.48 0 top
C8  146.05,75.56 0 top  (outside the outline)
C9  141.61,73.02 0 top  (outside the outline)
C10  76.2,74.93 0 top  (outside the outline)
C11  77.47,80.01 0 top  (outside the outline)
C12  76.2,77.47 0 top  (outside the outline)
C13  81.91,74.29 0 top  (outside the outline)
C14  85.09,73.02 0 top  (outside the outline)
C15  142.24,83.82 0 top  (outside the outline)
C16  116.2,84.45 0 top  (outside the outline)
C17  78.11,56.52 0 top
C18  79.38,39.37 0 top
C19  76.83,47.62 0 top
C20  139.06,78.1 0 top  (outside the outline)
C21  102.23,81.91 0 top  (outside the outline)
C22  145.41,80.64 0 top  (outside the outline)
C23  133.35,80.64 0 top  (outside the outline)
C24  67.94,33.66 90 top
C25  69.85,33.66 90 top
C26  73.66,33.66 90 top
C27  71.75,33.66 90 top
C28  75.56,33.66 270 top
C29  82.55,26.35 180 top
C30  80.64,22.86 180 top
C31  71.75,28.58 90 top
C32  73.66,28.58 90 top
C33  75.56,28.58 270 top
C34  108.59,78.1 0 top  (outside the outline)
C35  81.91,30.48 180 top
C36  80.64,20.32 0 top
C37  90.81,17.78 0 top
C38  81.91,17.78 0 top
C39  67.94,28.58 90 top
C40  69.85,28.58 90 top
C41  85.72,42.55 0 top
C42  83.82,19.69 0 top
C43  88.27,49.53 0 top
C44  77.47,20.32 0 top
C45  84.45,48.64 0 top
C46  93.88,27.3 270 top
C47  87.63,20.95 0 top
C48  90.81,20.95 180 top
D1  130.18,80.64 0 top  (outside the outline)
D2  80.01,44.45 0 top
FID1  105.41,72.39 0 top  (outside the outline)
FID2  127,76.2 0 top  (outside the outline)
FID3  142.24,76.83 0 top  (outside the outline)
IC1  89.53,40.64 0 top
IC2  137.16,74.93 0 top  (outside the outline)
IC3  121.28,20.32 0 top
IC4  120.65,39.37 0 top
IC5  72.39,50.8 0 top
IC6  95.25,78.74 0 top  (outside the outline)
IC7  89.77,30.34 0 top
J1  86.36,83.18 0 top  (outside the outline)
J2  139.06,62.87 180 top
J3  99.06,86.36 0 top  (outside the outline)
J4  144.14,51.44 90 top
J5  127.64,85.72 0 top  (outside the outline)
J6  136.53,31.12 90 top
L1  92.71,86.99 0 top  (outside the outline)
L2  111.76,73.66 0 top  (outside the outline)
L3  71.75,45.09 270 top
L4  560nH  [0603']  81.91,33.66 0 top
L5  87.38,17.65 180 top
L6  88.52,46.36 0 top
L7  560nH  [0603']  80.96,27.94 0 top
LED1  81.28,76.2 0 top  (outside the outline)
LED2  123.19,71.75 0 top  (outside the outline)
LED3  122.56,80.64 0 top  (outside the outline)
LED4  76.2,80.64 0 top  (outside the outline)
LED5  139.06,86.36 0 top  (outside the outline)
LED6  121.28,87.63 0 top  (outside the outline)
LED7  102.23,79.38 0 top  (outside the outline)
LED8  135.89,80.01 0 top  (outside the outline)
LED9  144.78,78.74 0 top  (outside the outline)
LED10  120.65,85.09 0 top  (outside the outline)
Q1  120.65,76.2 0 top  (outside the outline)
Q2  134.62,85.72 0 top  (outside the outline)
Q3  87.63,52.7 0 top
Q4  128.91,62.87 270 top
Q5  79.38,50.16 270 top
Q6  109.85,78.74 0 top  (outside the outline)
Q7  88.9,24.13 0 top
R1  117.47,83.18 0 top  (outside the outline)
R2  75.56,76.2 0 top  (outside the outline)
R3  89.53,86.36 0 top  (outside the outline)
R4  130.81,73.66 0 top  (outside the outline)
R5  85.72,77.47 0 top  (outside the outline)
R6  133.99,78.1 0 top  (outside the outline)
R7  87.63,73.66 0 top  (outside the outline)
R8  81.28,80.01 0 top  (outside the outline)
R9  85.72,78.74 0 top  (outside the outline)
R10  95.25,81.28 0 top  (outside the outline)
R11  86.36,80.64 0 top  (outside the outline)
R12  79.38,81.28 0 top  (outside the outline)
R13  78.74,78.1 0 top  (outside the outline)
R14  84.45,79.38 0 top  (outside the outline)
R15  81.91,76.83 0 top  (outside the outline)
R16  133.99,74.93 0 top  (outside the outline)
R17  109.85,71.75 270 top  (outside the outline)
R18  83.82,59.69 180 top
R19  98.42,71.75 0 top  (outside the outline)
R20  111.76,74.29 90 top  (outside the outline)
R21  80.01,66.04 0 top
R22  71.75,57.15 180 top
R23  87.63,86.99 0 top  (outside the outline)
R24  133.35,73.02 0 top  (outside the outline)
R25  87,64.13 180 top
R26  84.45,63.5 0 top
R27  76.83,52.7 180 top
R28  93.98,72.39 0 top  (outside the outline)
R29  119.38,81.28 0 top  (outside the outline)
R30  84.45,17.78 0 top
R31  66.04,34.92 270 top
R32  139.06,82.55 0 top  (outside the outline)
R33  61.79,32.38 270 top
R34  96.52,78.1 0 top  (outside the outline)
R35  61.79,34.92 270 top
R36  84.45,24.13 90 top
R37  81.28,24.77 0 top
R38  66.04,27.3 270 top
S$1  74.93,2.54 0 top
TP1  65.74,37.83 0 top
TP2  78.05,27.94 0 top
TP3  78.05,31.04 0 top
TP4  78.05,34.15 0 top
TP5  65.74,31.04 0 top
TP6  65.74,24.26 0 top
TP7  78.05,24.51 0 top
U1  142.24,20.32 180 top
U$6  [MOUNTINGHOLE_3.0]  4.45,63.5 0 top
U$36  [MOUNTINGHOLE_3.0]  4.45,4.44 0 top
U$37  [MOUNTINGHOLE_3.0]  149.22,4.44 0 top
U$38  [MOUNTINGHOLE_3.0]  149.22,63.5 0 top

### Tracks (layer width: path | path; a pad name or v marks a point on that pad's centre or on a via)
1V8_OUT  (5 unrouted)
1V8A  (4 unrouted)
1V8OUT  (2 unrouted)
3V3A  (6 unrouted)
!PN532_CS  (2 unrouted)
!PN532_CS_3V3  (via drill 0.4)  (1 unrouted)
  Top 0.254: IC7.27 93.95,31.09 94.62,31.75 v94.62,38.73
!RESET  (4 unrouted)
!SD_CD  (2 unrouted)
!SD_CS  (2 unrouted)
!W5100_CS  (2 unrouted)
!W5100_RESET  (1 unrouted)
+3V3  (via drill 0.4)  (27 unrouted)
  Top 0.254: IC1.2 89.56,38.71 88.9,39.37 86.04,39.37 84.08,37.41 C2.1 85.09,36.2 86.04,35.24 v87,35.24 87,34.29 87.52,33.77 IC7.40 IC7.39 | IC7.23 93.22,29.09 v93.98,29.84 | IC7.37 89.02,34.41 v89.53,34.92
  Bottom 0.254: v93.98,29.84 89.53,34.29 v89.53,34.92 88.58,34.92 88.27,35.24 v87,35.24
+5V  (via drill 0.4)  (13 unrouted)
  Top 0.254: 81.28,52.7 81.28,59.69 82.55,60.96 85.72,60.96 86.36,61.59 86.36,64.01 R25.2 | v83.19,39.37 84.45,39.37 85.09,40.01 90.81,40.01 92.08,41.27 92.08,45.09 91.44,45.72 Q3.+
  Top 0.406: L3.P$2 73.25,39.35 v75.56,39.37 C18.1 | 91.77,39.04 90.81,40.01 | R27.1 81.28,52.7 83.19,54.61 89.53,54.61 Q3.+
  Bottom 0.406: v75.56,39.37 v83.19,39.37
+12V  (via drill 0.4)  (4 unrouted)
  Top 0.406: C17.+ 74.93,56.52 74.3,57.15 R22.1 73.03,57.02 IC5.6 v73.03,50.8
  Bottom 0.813: v73.03,50.8 73.03,20.95
AREF  (1 unrouted)
BUZZER  (via drill 0.4)  (1 unrouted)
  Top 0.406: R18.1 87.63,59.69 94.62,52.7 v94.62,43.82
COLLED  (1 unrouted)
FDXLED  (2 unrouted)
FOO  (2 unrouted)
GND  (via drill 0.4)  (42 unrouted)
  Top 0.203: IC7.7 88.71,29.59 88.72,29.59 | IC7.3 88.17,31.59 arc90 88.21,31.62 88.21,32.13 87.95,32.13 | IC7.18 91.02,29.09
  Top 0.356: R33.1 v61.79,33.66 R35.2
  Top 0.406: 88.71,29.59 89.02,29.59 IC7.TP
  other vias: 65.71,31.07
  pour Top (isolate 0.406): 76.53,32.38 79.83,32.38 79.83,29.34 76.53,29.34
  pour Bottom (isolate 0.406): -1.27,-0.64 154.94,-0.64 154.94,68.58 -1.27,68.58
  pour Top: 66.04,68.58 154.94,68.58 154.94,-0.64 66.04,-0.64
LED1  (1 unrouted)
LED2  (1 unrouted)
LINKLED  (2 unrouted)
MISO  (4 unrouted)
MOSI  (3 unrouted)
MOSI_3.3V  (via drill 0.4)  (2 unrouted)
  Top 0.254: IC7.28 93.66,31.59 93.98,31.91 93.98,33.66 93.34,34.29 93.34,40.01 v94.62,41.27
N$1
  Top 0.254: IC7.4 85.44,31.09 82.87,33.66 L4.2
N$2
  Top 0.254: IC7.6 85.01,30.09 82.87,27.94 L7.2
N$3
  Top 0.203: 77.5,33.61 78.05,33.61 78.05,33.53
  Top 0.254: L4.1 78.54,33.66 TP4.P$1 | C27.1 C26.1 C28.2 76.78,32.89 77.5,33.61
  Top 0.406: TP4.P$1 77.5,34.1 77.5,33.61 | 78.05,33.53 78.18,33.4
N$4
  Top 0.356: R33.2 61.79,11.56 61.28,11.05 10.74,11.05 9.98,11.81 9.98,30.35 8.96,31.37 8.96,50.93 9.98,51.94 61.54,51.94 62.81,50.67 62.81,31.88 63.82,30.86 63.82,9.78 63.06,9.02 8.96,9.02 7.95,10.03 7.95,30.35 6.93,31.37 6.93,51.94 8.96,53.98 63.06,53.98 64.85,52.19 64.85,38.72 TP1.P$1 65.74,36.66 66.04,36.35 R31.1
N$5  (via drill 0.4)
  Top 0.254: 65.72,24.27 TP6.P$1
  Top 0.356: v6.93,29.84 6.93,9.52 8.45,8 63.57,8 64.85,9.28 64.85,23.37 TP6.P$1 65.74,25.57 66.04,25.88 R38.2 | v7.95,31.88 7.95,51.44 9.47,52.96 62.3,52.96 63.82,51.44 v63.82,32.26 | v62.81,30.48 62.81,10.54 62.3,10.03 9.72,10.03 8.96,10.79 v8.96,29.84 | v9.98,31.88 9.98,50.16 10.74,50.93 61.03,50.93 61.79,50.16 R35.1
  Top 0.406: TP6.P$1 65.61,24.38
  Bottom 0.406: v7.95,31.88 v6.93,29.84 | v63.82,32.26 v62.81,30.48 | v8.96,29.84 v9.98,31.88
N$6
  Top 0.406: IC5.8 70.48,57.02 R22.2 | IC5.7 IC5.8 | IC5.1 IC5.8
N$7
  Top 0.254: IC7.14 89.02,24.63 87.68,23.29 87.36,23.29 Q7.1 86.87,22.8 C47.1
N$8
  Top 0.254: IC7.15 89.52,26.08 90.12,25.48 90.55,25.48 Q7.3 90.95,25.08 91.28,25.08 92.23,24.13 92.23,21.59 91.6,20.95 C48.1
N$9
  Top 0.254: C30.1 81.41,23.46 82.04,24.1 R37.2
N$10
  Top 0.254: 83.34,26.35 85.57,28.58 IC7.9 | C29.1 83.34,26.35 | 83.34,26.35 83.34,25.4 83.85,24.89 R36.2
N$11
  Top 0.254: IC7.10 85.25,26.54 85.25,24.16 R36.1 | R36.1 84.45,23.49 | C30.2 79.88,22.83 80.64,22.07 83.15,22.07 R36.1
N$12
  Top 0.254: L7.1 TP2.P$1 TP7.P$1 78.3,24.77 R37.1 | C31.2 C32.2 C33.1 76.65,29.34 TP2.P$1
  Top 0.406: TP2.P$1
N$13  (3 unrouted)
N$14  (3 unrouted)
N$15  (2 unrouted)
  Top 0.254: IC7.5 82.92,30.59 C35.1
N$16
  Top 0.406: IC5.3 73.03,49.21 73.98,50.16 75.09,50.16 76.07,49.18 C19.1
N$17  (2 unrouted)
  Top 0.406: R27.2 74.3,52.7
N$18  (1 unrouted)
  Top 0.254: 87.75,64.15 R25.1
N$19  (3 unrouted)
N$20  (2 unrouted)
N$21
  Top 0.406: D2.C 75.56,44.45 74.93,45.09 L3.P$1 IC5.2
N$22  (3 unrouted)
  Top 0.406: 124.46,61.59 125.09,60.96 126.36,60.96
N$23  (via drill 0.4)  (1 unrouted)
  Top 0.254: v83.19,55.88 83.19,59.56 R18.2
  Top 0.406: Q5.1 77.23,51.12 v76.6,51.12
  Bottom 0.406: v76.6,51.12 78.42,51.12 v83.19,55.88
N$24  (2 unrouted)
N$26  (1 unrouted)
  Top 3.302: Q4.MB J2.2
N$30
  Top 0.406: Q5.3 81.28,50.16 Q3.-
N$44  (1 unrouted)
N$45  (1 unrouted)
N$50  (2 unrouted)
N$51  (2 unrouted)
N$55  (3 unrouted)
N$56  (1 unrouted)
N$57  (1 unrouted)
N$59  (1 unrouted)
N$62  (1 unrouted)
N$63  (1 unrouted)
N$67  (1 unrouted)
N$68  (1 unrouted)
N$322  (1 unrouted)
N$327  (1 unrouted)
N$328  (1 unrouted)
N$329  (1 unrouted)
N$330  (1 unrouted)
N$332  (1 unrouted)
RSTPD_N  (1 unrouted)
RXD  (1 unrouted)
RXIN  (2 unrouted)
RXIP  (2 unrouted)
SCK  (4 unrouted)
SCK_3.3V  (2 unrouted)
SEN  (2 unrouted)
SOLENOID  (1 unrouted)
SPDLED  (1 unrouted)
TX1_ANTENNA
  Top 0.254: C24.2 C25.2 C27.2 C26.2
  Top 0.356: R31.2 66.87,34.16 67.12,34.42 C24.2
TX2_ANTENNA
  Top 0.254: 73.53,27.94 C32.1 C31.1 C40.1 C39.1
  Top 0.356: R38.1 66.87,28.07 67.12,27.81 C39.1
TXD  (1 unrouted)
TXON  (2 unrouted)
TXOP  (2 unrouted)
W5100_INT  (1 unrouted)
WRXLED  (1 unrouted)
WTXLED  (1 unrouted)

### Text on the board
tPlace: TX1 | C9 | C7 | C1 | C5 | C3 | R3 | L3 | TX1 | L4 | R4 | TX2 | C8 | C2 | C6 | C4 | C10 | TX2 | R2